# Altium schematic sheet motordriver-v5.0_connectors-dribbler.SchDoc
size A4; SheetNumber: 9; SheetTotal: 10
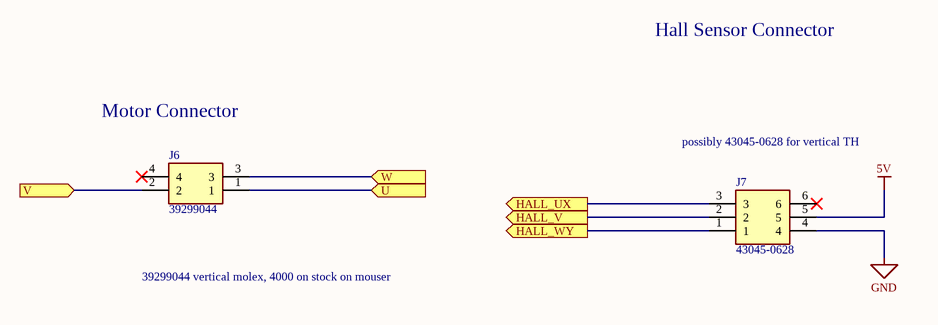
[diagram p0: motordriver-v5.0_connectors-dribbler.SchDoc]

## Parts
J6  39299044  [39299044]
J7  43045-0628  [430450628]

## Ports
HALL_UX (out), HALL_V (out), HALL_WY (out), U (in), V (in), W (in)

## Nets
5V: J7.5
GND: J7.4
HALL_UX: J7.3 ; port HALL_UX
HALL_V: J7.2 ; port HALL_V
HALL_WY: J7.1 ; port HALL_WY
U: J6.1 ; port U
V: J6.2 ; port V
W: J6.3 ; port W

Not connected (* = marked no-connect by the designer): J6 4*; J7 6*

## Notes on the sheet
- Hall Sensor Connector
- Motor Connector
- possibly 43045-0628 for vertical TH
- 39299044 vertical molex, 4000 on stock on mouser

## Library data of the parts
J6 = CN HDR 4POS Molex 39299044 VERT: Molex 39299044 4POS Minifit / dual row, vertical; Supplier 1: Digi-Key; Supplier Part Number 1: WM7336-ND; Part Number: CN HDR 4POS Molex 39299044 VERT; Manufacturer Part Number: 39299044; Supplier URL 1: https://www.digikey.ca/en/products/detail/molex/0039299044/1624292?s=N4IgTCBcDaIOoFkDsBmFA2AtAOQCIgF0BfIA; Pin Count: 4
J7 = CN HDR 6POS Molex 43045-0628: Molex 43045-0628 6POS Microfit / dual row, Vertical; Supplier 1: Digi-Key; Supplier Part Number 1: WM10679-ND; Part Number: CN HDR 6POS Molex 43045-0628; Manufacturer Part Number: 430450628; Supplier URL 1: https://www.digikey.ca/en/products/detail/molex/0430450628/3310200?s=N4IgTCBcDaICwGYAMcCsSBsYAcAdXIAugL5A; Pin Count: 6